# EAGLE schematic Main_bord (EAGLE 8.3.2)
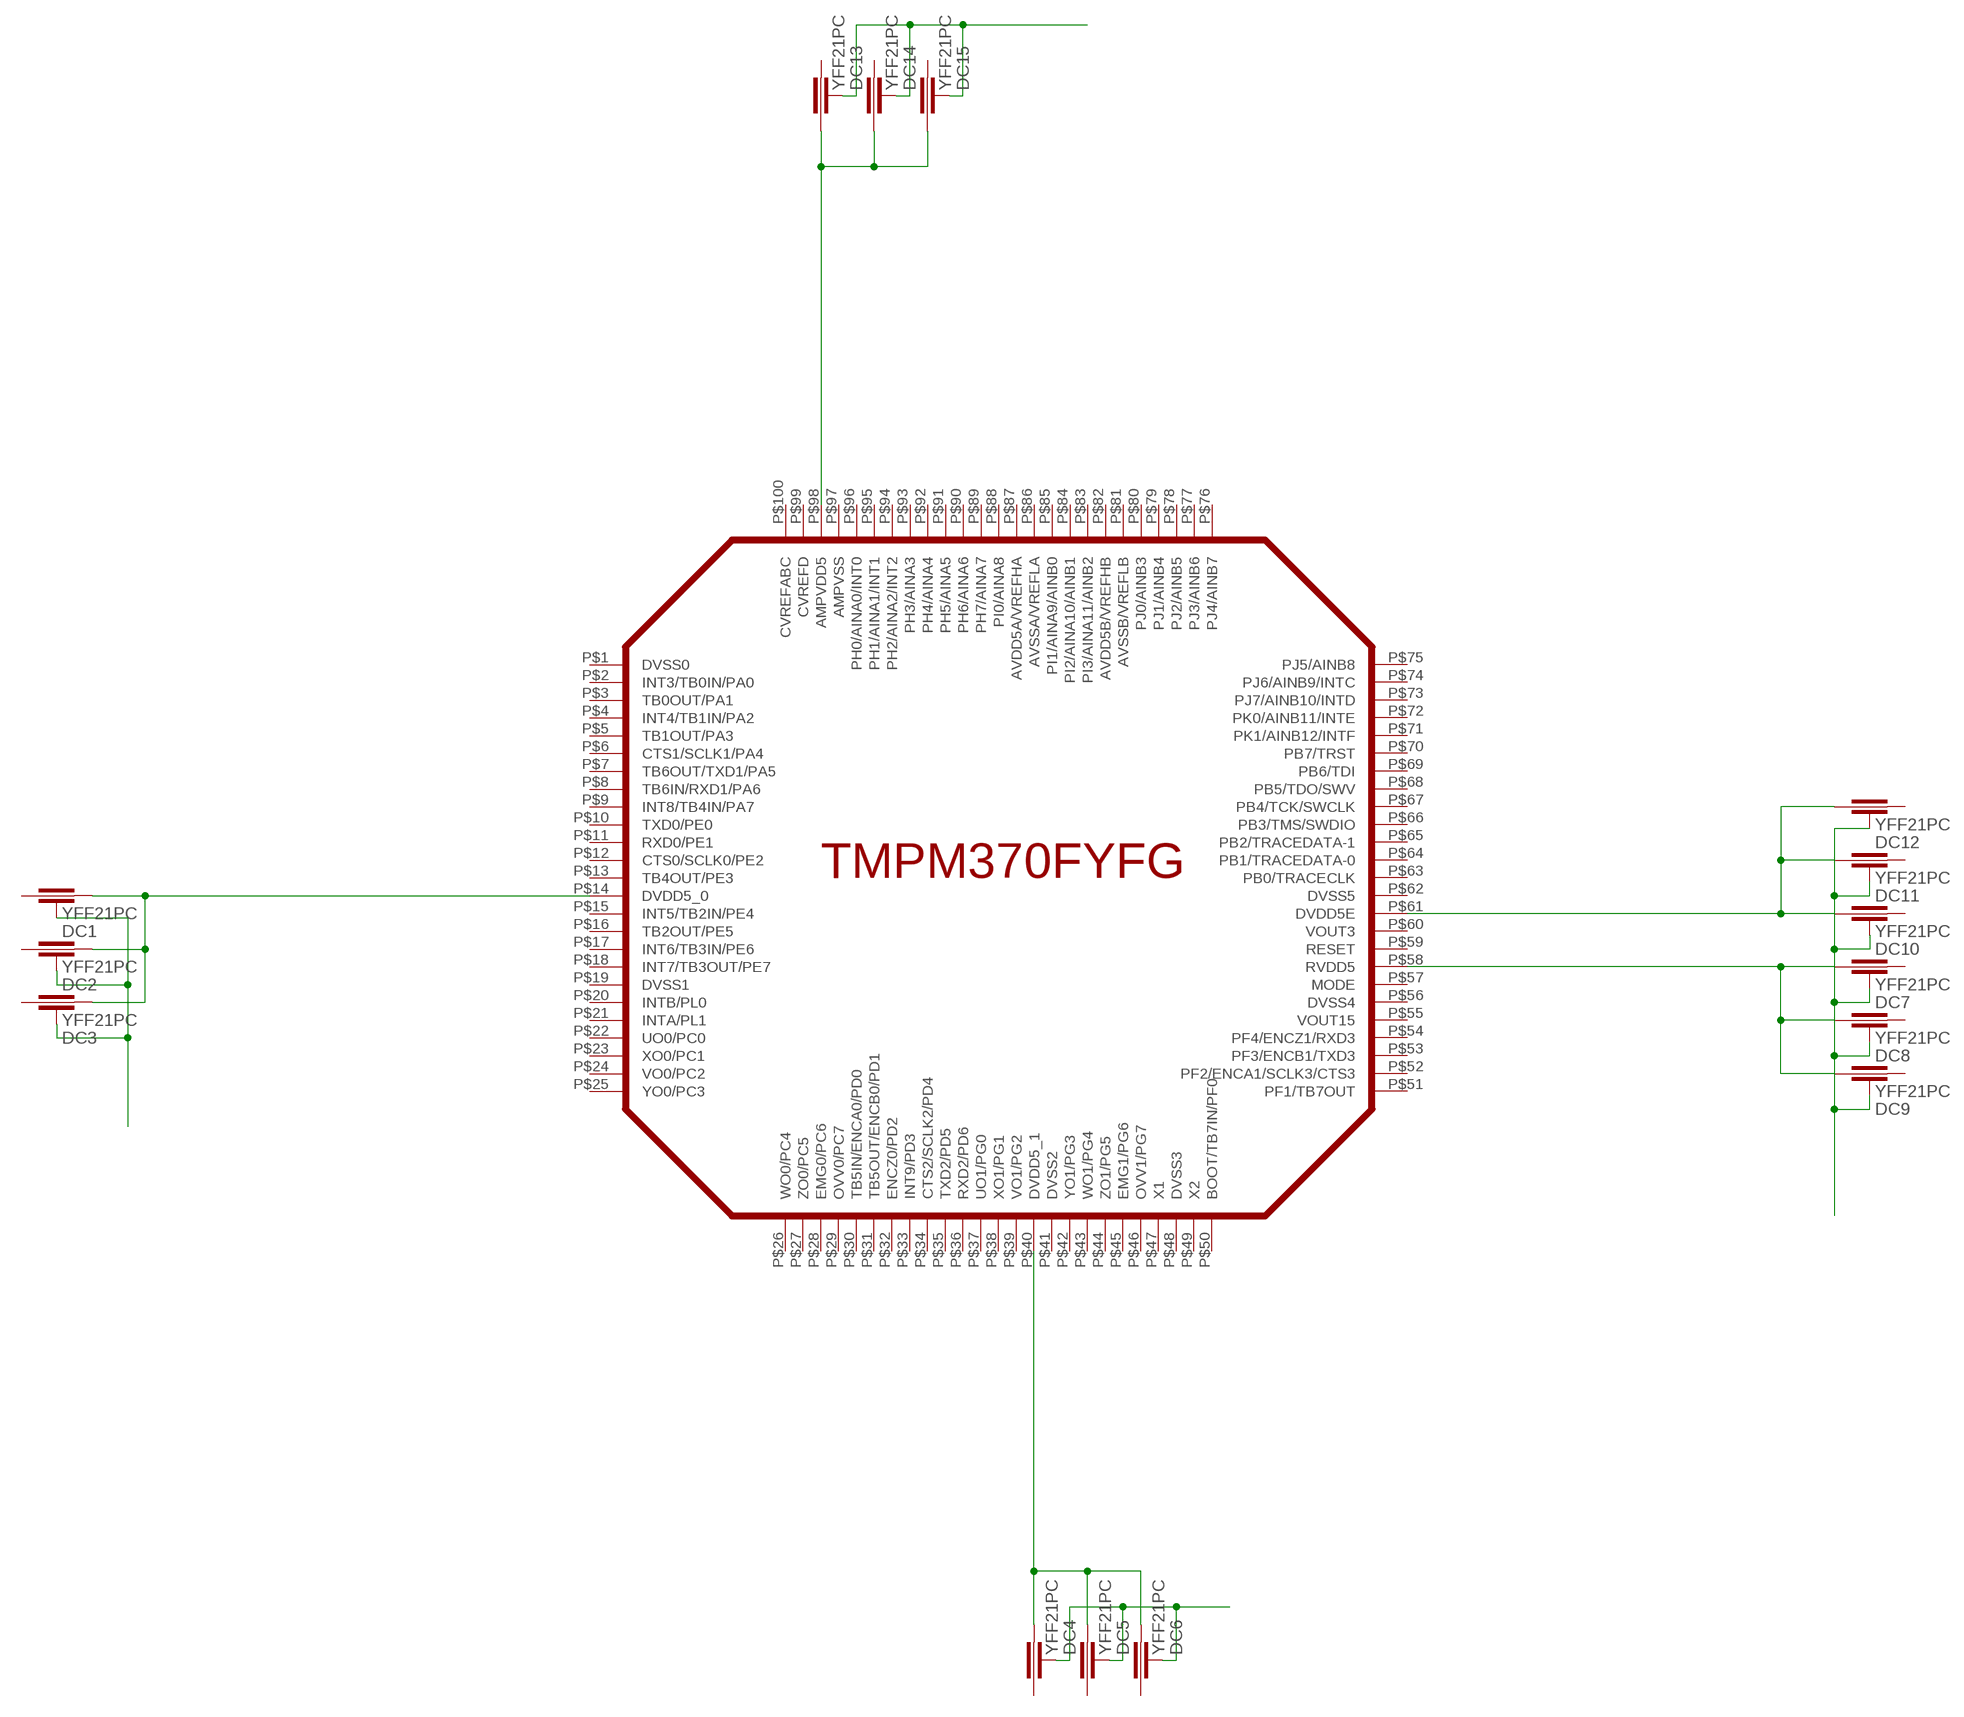
[diagram p0: schematic, sheet 1]

## Parts
DC1  YFF21PC  [YFF21PC]
DC2  YFF21PC  [YFF21PC]
DC3  YFF21PC  [YFF21PC]
DC4  YFF21PC  [YFF21PC]
DC5  YFF21PC  [YFF21PC]
DC6  YFF21PC  [YFF21PC]
DC7  YFF21PC  [YFF21PC]
DC8  YFF21PC  [YFF21PC]
DC9  YFF21PC  [YFF21PC]
DC10  YFF21PC  [YFF21PC]
DC11  YFF21PC  [YFF21PC]
DC12  YFF21PC  [YFF21PC]
DC13  YFF21PC  [YFF21PC]
DC14  YFF21PC  [YFF21PC]
DC15  YFF21PC  [YFF21PC]
IC1  TMPM370FYFG  [LQFP100-P-1414-0.50H]

## Nets
N$1: DC4.P$2 DC5.P$2 DC6.P$2 IC1.P$40(DVDD5_1)
N$2: DC7.P$1 DC8.P$1 DC9.P$1 IC1.P$58(RVDD5)
N$3: DC10.P$1 DC11.P$1 DC12.P$1 IC1.P$61(DVDD5E)
N$4: DC13.P$1 DC14.P$1 DC15.P$1 IC1.P$98(AMPVDD5)
N$5: DC1.P$2 DC2.P$2 DC3.P$2 IC1.P$14(DVDD5_0)
N$6: DC1.GND1(GND) DC1.GND2(GND) DC2.GND1(GND) DC2.GND2(GND) DC3.GND1(GND) DC3.GND2(GND)
N$7: DC7.GND1(GND) DC7.GND2(GND) DC8.GND1(GND) DC8.GND2(GND) DC9.GND1(GND) DC9.GND2(GND) DC10.GND1(GND) DC10.GND2(GND) DC11.GND1(GND) DC11.GND2(GND) DC12.GND1(GND) DC12.GND2(GND)
N$10: DC4.GND1(GND) DC4.GND2(GND) DC5.GND1(GND) DC5.GND2(GND) DC6.GND1(GND) DC6.GND2(GND)
N$11: DC13.GND1(GND) DC13.GND2(GND) DC14.GND1(GND) DC14.GND2(GND) DC15.GND1(GND) DC15.GND2(GND)
Unconnected: DC1.P$1 DC2.P$1 DC3.P$1 DC4.P$1 DC5.P$1 DC6.P$1 DC7.P$2 DC8.P$2 DC9.P$2 DC10.P$2 DC11.P$2 DC12.P$2 DC13.P$2 DC14.P$2 DC15.P$2 IC1.P$1(DVSS0) IC1.P$2(INT3/TB0IN/PA0) IC1.P$3(TB0OUT/PA1) IC1.P$4(INT4/TB1IN/PA2) IC1.P$5(TB1OUT/PA3) IC1.P$6(CTS1/SCLK1/PA4) IC1.P$7(TB6OUT/TXD1/PA5) IC1.P$8(TB6IN/RXD1/PA6) IC1.P$9(INT8/TB4IN/PA7) IC1.P$10(TXD0/PE0) IC1.P$11(RXD0/PE1) IC1.P$12(CTS0/SCLK0/PE2) IC1.P$13(TB4OUT/PE3) IC1.P$15(INT5/TB2IN/PE4) IC1.P$16(TB2OUT/PE5) IC1.P$17(INT6/TB3IN/PE6) IC1.P$18(INT7/TB3OUT/PE7) IC1.P$19(DVSS1) IC1.P$20(INTB/PL0) IC1.P$21(INTA/PL1) IC1.P$22(UO0/PC0) IC1.P$23(XO0/PC1) IC1.P$24(VO0/PC2) IC1.P$25(YO0/PC3) IC1.P$26(WO0/PC4) IC1.P$27(ZO0/PC5) IC1.P$28(EMG0/PC6) IC1.P$29(OVV0/PC7) IC1.P$30(TB5IN/ENCA0/PD0) IC1.P$31(TB5OUT/ENCB0/PD1) IC1.P$32(ENCZ0/PD2) IC1.P$33(INT9/PD3) IC1.P$34(CTS2/SCLK2/PD4) IC1.P$35(TXD2/PD5) IC1.P$36(RXD2/PD6) IC1.P$37(UO1/PG0) IC1.P$38(XO1/PG1) IC1.P$39(VO1/PG2) IC1.P$41(DVSS2) IC1.P$42(YO1/PG3) IC1.P$43(WO1/PG4) IC1.P$44(ZO1/PG5) IC1.P$45(EMG1/PG6) IC1.P$46(OVV1/PG7) IC1.P$47(X1) IC1.P$48(DVSS3) IC1.P$49(X2) IC1.P$50(BOOT/TB7IN/PF0) IC1.P$51(PF1/TB7OUT) IC1.P$52(PF2/ENCA1/SCLK3/CTS3) IC1.P$53(PF3/ENCB1/TXD3) IC1.P$54(PF4/ENCZ1/RXD3) IC1.P$55(VOUT15) IC1.P$56(DVSS4) IC1.P$57(MODE) IC1.P$59(RESET) IC1.P$60(VOUT3) IC1.P$62(DVSS5) IC1.P$63(PB0/TRACECLK) IC1.P$64(PB1/TRACEDATA-0) IC1.P$65(PB2/TRACEDATA-1) IC1.P$66(PB3/TMS/SWDIO) IC1.P$67(PB4/TCK/SWCLK) IC1.P$68(PB5/TDO/SWV) IC1.P$69(PB6/TDI) IC1.P$70(PB7/TRST) IC1.P$71(PK1/AINB12/INTF) IC1.P$72(PK0/AINB11/INTE) IC1.P$73(PJ7/AINB10/INTD) IC1.P$74(PJ6/AINB9/INTC) IC1.P$75(PJ5/AINB8) IC1.P$76(PJ4/AINB7) IC1.P$77(PJ3/AINB6) IC1.P$78(PJ2/AINB5) IC1.P$79(PJ1/AINB4) IC1.P$80(PJ0/AINB3) IC1.P$81(AVSSB/VREFLB) IC1.P$82(AVDD5B/VREFHB) IC1.P$83(PI3/AINA11/AINB2) IC1.P$84(PI2/AINA10/AINB1) IC1.P$85(PI1/AINA9/AINB0) IC1.P$86(AVSSA/VREFLA) IC1.P$87(AVDD5A/VREFHA) IC1.P$88(PI0/AINA8) IC1.P$89(PH7/AINA7) IC1.P$90(PH6/AINA6) IC1.P$91(PH5/AINA5) IC1.P$92(PH4/AINA4) IC1.P$93(PH3/AINA3) IC1.P$94(PH2/AINA2/INT2) IC1.P$95(PH1/AINA1/INT1) IC1.P$96(PH0/AINA0/INT0) IC1.P$97(AMPVSS) IC1.P$99(CVREFD) IC1.P$100(CVREFABC)

## Library data of the parts
DC1-DC15 = TDK:YFF21PC
IC1 = TOSHIBA:TMPM370FYFG